# EAGLE design main.02 (EAGLE 9.5.1)

## Sheet 1 of 3: MSP430FR5989 Main Components
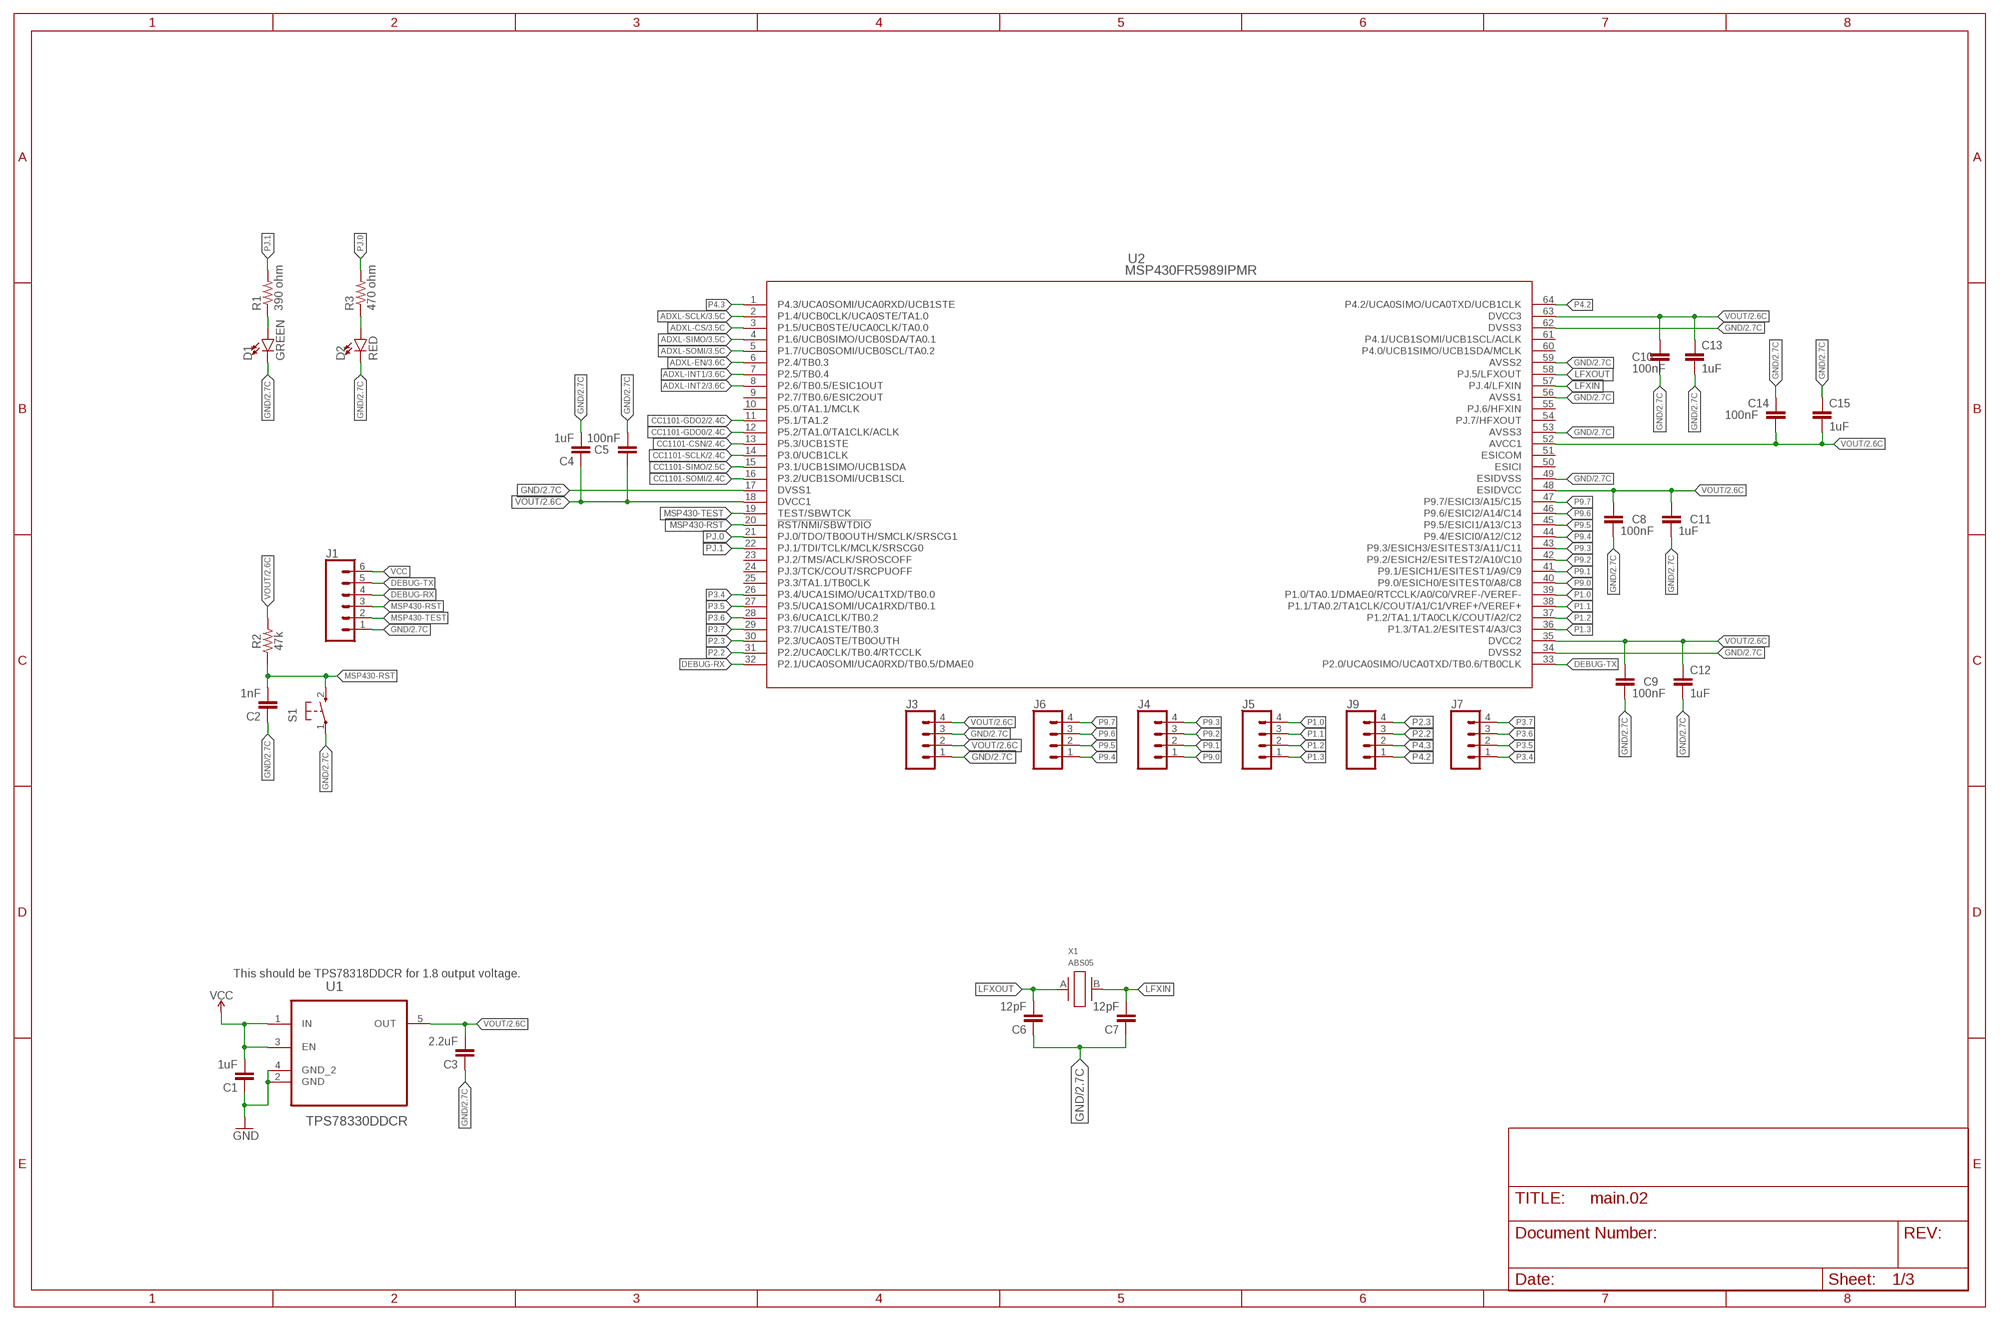
[diagram p0: schematic, sheet 1]

### Parts
C1  1uF  C-EU0603  [0603]
C2  1nF  C-EU0603  [0603]
C3  2.2uF  C-EU0603  [0603]
C4  1uF  C-EU0603  [0603]
C5  100nF  C-EU0603  [0603]
C6  12pF  C-EU0603  [0603]
C7  12pF  C-EU0603  [0603]
C8  100nF  C-EU0603  [0603]
C9  100nF  C-EU0603  [0603]
C10  100nF  C-EU0603  [0603]
C11  1uF  C-EU0603  [0603]
C12  1uF  C-EU0603  [0603]
C13  1uF  C-EU0603  [0603]
C14  100nF  C-EU0603  [0603]
C15  1uF  C-EU0603  [0603]
D1  GREEN  LED-GREEN0603  [LED-0603]
D2  RED  LED-RED0603  [LED-0603]
J1  CONN_06SILK_FEMALE_PTH  [1X06]
J3  CONN_041.27MM  [1X04_1.27MM]
J4  CONN_041.27MM  [1X04_1.27MM]
J5  CONN_041.27MM  [1X04_1.27MM]
J6  CONN_041.27MM  [1X04_1.27MM]
J7  CONN_041.27MM  [1X04_1.27MM]
J9  CONN_041.27MM  [1X04_1.27MM]
R1  390 ohm  R-EU  [0402]
R2  47k  47KOHM-0603-1/10W-1%  [0603]
R3  470 ohm  R-EU  [0402]
S1  ELECTRICALMETER_PB  [ELECTRICALMETER_PBTH]
U1  TPS78330DDCR  [SOT95P280X110-5N]
U2  MSP430FR5989IPMR  [PM64]
X1  ABS05  ABS05-32.768KHZ-9-T  [ABS05]

### Nets
ADXL-CS: U2.3(P1.5/UCB0STE/UCA0CLK/TA0.0) ; also sheet 3
ADXL-EN: U2.6(P2.4/TB0.3) ; also sheet 3
ADXL-INT1: U2.7(P2.5/TB0.4) ; also sheet 3
ADXL-INT2: U2.8(P2.6/TB0.5/ESIC1OUT) ; also sheet 3
ADXL-SCLK: U2.2(P1.4/UCB0CLK/UCA0STE/TA1.0) ; also sheet 3
ADXL-SIMO: U2.4(P1.6/UCB0SIMO/UCB0SDA/TA0.1) ; also sheet 3
ADXL-SOMI: U2.5(P1.7/UCB0SOMI/UCB0SCL/TA0.2) ; also sheet 3
CC1101-CSN: U2.13(P5.3/UCB1STE) ; also sheet 2
CC1101-GDO0: U2.12(P5.2/TA1.0/TA1CLK/ACLK) ; also sheet 2
CC1101-GDO2: U2.11(P5.1/TA1.2) ; also sheet 2
CC1101-SCLK: U2.14(P3.0/UCB1CLK) ; also sheet 2
CC1101-SIMO: U2.15(P3.1/UCB1SIMO/UCB1SDA) ; also sheet 2
CC1101-SOMI: U2.16(P3.2/UCB1SOMI/UCB1SCL) ; also sheet 2
DEBUG-RX: J1.4 U2.32(P2.1/UCA0SOMI/UCA0RXD/TB0.5/DMAE0)
DEBUG-TX: J1.5 U2.33(P2.0/UCA0SIMO/UCA0TXD/TB0.6/TB0CLK)
GND: C1.1 C2.1 C3.1 C4.2 C5.2 C6.1 C7.1 C8.2 C9.2 C10.2 C11.2 C12.2 C13.2 C14.1 C15.1 D1.C D2.C J1.1 J3.1 J3.3 S1.1(P) U1.2(GND) U1.4(GND_2) U2.17(DVSS1) U2.34(DVSS2) U2.49(ESIDVSS) U2.53(AVSS3) U2.56(AVSS1) U2.59(AVSS2) U2.62(DVSS3) ; also sheet 2,3
LFXIN: C7.2 U2.57(PJ.4/LFXIN) X1.B
LFXOUT: C6.2 U2.58(PJ.5/LFXOUT) X1.A
MSP430-RST: C2.2 J1.3 R2.1 S1.2(S) U2.20(!RST/NMI/SBWTDIO)
MSP430-TEST: J1.2 U2.19(TEST/SBWTCK)
N$19: D1.A R1.1
N$20: D2.A R3.1
P1.0: J5.4 U2.39(P1.0/TA0.1/DMAE0/RTCCLK/A0/C0/VREF-/VEREF-)
P1.1: J5.3 U2.38(P1.1/TA0.2/TA1CLK/COUT/A1/C1/VREF+/VEREF+)
P1.2: J5.2 U2.37(P1.2/TA1.1/TA0CLK/COUT/A2/C2)
P1.3: J5.1 U2.36(P1.3/TA1.2/ESITEST4/A3/C3)
P2.2: J9.3 U2.31(P2.2/UCA0CLK/TB0.4/RTCCLK)
P2.3: J9.4 U2.30(P2.3/UCA0STE/TB0OUTH)
P3.4: J7.1 U2.26(P3.4/UCA1SIMO/UCA1TXD/TB0.0)
P3.5: J7.2 U2.27(P3.5/UCA1SOMI/UCA1RXD/TB0.1)
P3.6: J7.3 U2.28(P3.6/UCA1CLK/TB0.2)
P3.7: J7.4 U2.29(P3.7/UCA1STE/TB0.3)
P4.2: J9.1 U2.64(P4.2/UCA0SIMO/UCA0TXD/UCB1CLK)
P4.3: J9.2 U2.1(P4.3/UCA0SOMI/UCA0RXD/UCB1STE)
P9.0: J4.1 U2.40(P9.0/ESICH0/ESITEST0/A8/C8)
P9.1: J4.2 U2.41(P9.1/ESICH1/ESITEST1/A9/C9)
P9.2: J4.3 U2.42(P9.2/ESICH2/ESITEST2/A10/C10)
P9.3: J4.4 U2.43(P9.3/ESICH3/ESITEST3/A11/C11)
P9.4: J6.1 U2.44(P9.4/ESICI0/A12/C12)
P9.5: J6.2 U2.45(P9.5/ESICI1/A13/C13)
P9.6: J6.3 U2.46(P9.6/ESICI2/A14/C14)
P9.7: J6.4 U2.47(P9.7/ESICI3/A15/C15)
PJ.0: R3.2 U2.21(PJ.0/TDO/TB0OUTH/SMCLK/SRSCG1)
PJ.1: R1.2 U2.22(PJ.1/TDI/TCLK/MCLK/SRSCG0)
VCC: C1.2 J1.6 U1.1(IN) U1.3(EN)
VOUT: C3.2 C4.1 C5.1 C8.1 C9.1 C10.1 C11.1 C12.1 C13.1 C14.2 C15.2 J3.2 J3.4 R2.2 U1.5(OUT) U2.18(DVCC1) U2.35(DVCC2) U2.48(ESIDVCC) U2.52(AVCC1) U2.63(DVCC3) ; also sheet 2,3
Unconnected: U2.9(P2.7/TB0.6/ESIC2OUT) U2.10(P5.0/TA1.1/MCLK) U2.23(PJ.2/TMS/ACLK/SROSCOFF) U2.24(PJ.3/TCK/COUT/SRCPUOFF) U2.25(P3.3/TA1.1/TB0CLK) U2.50(ESICI) U2.51(ESICOM) U2.54(PJ.7/HFXOUT) U2.55(PJ.6/HFXIN) U2.60(P4.0/UCB1SIMO/UCB1SDA/MCLK) U2.61(P4.1/UCB1SOMI/UCB1SCL/ACLK)

### Notes on the sheet
- This should be TPS78318DDCR for 1.8 output voltage.

## Sheet 2 of 3: CC1101 components
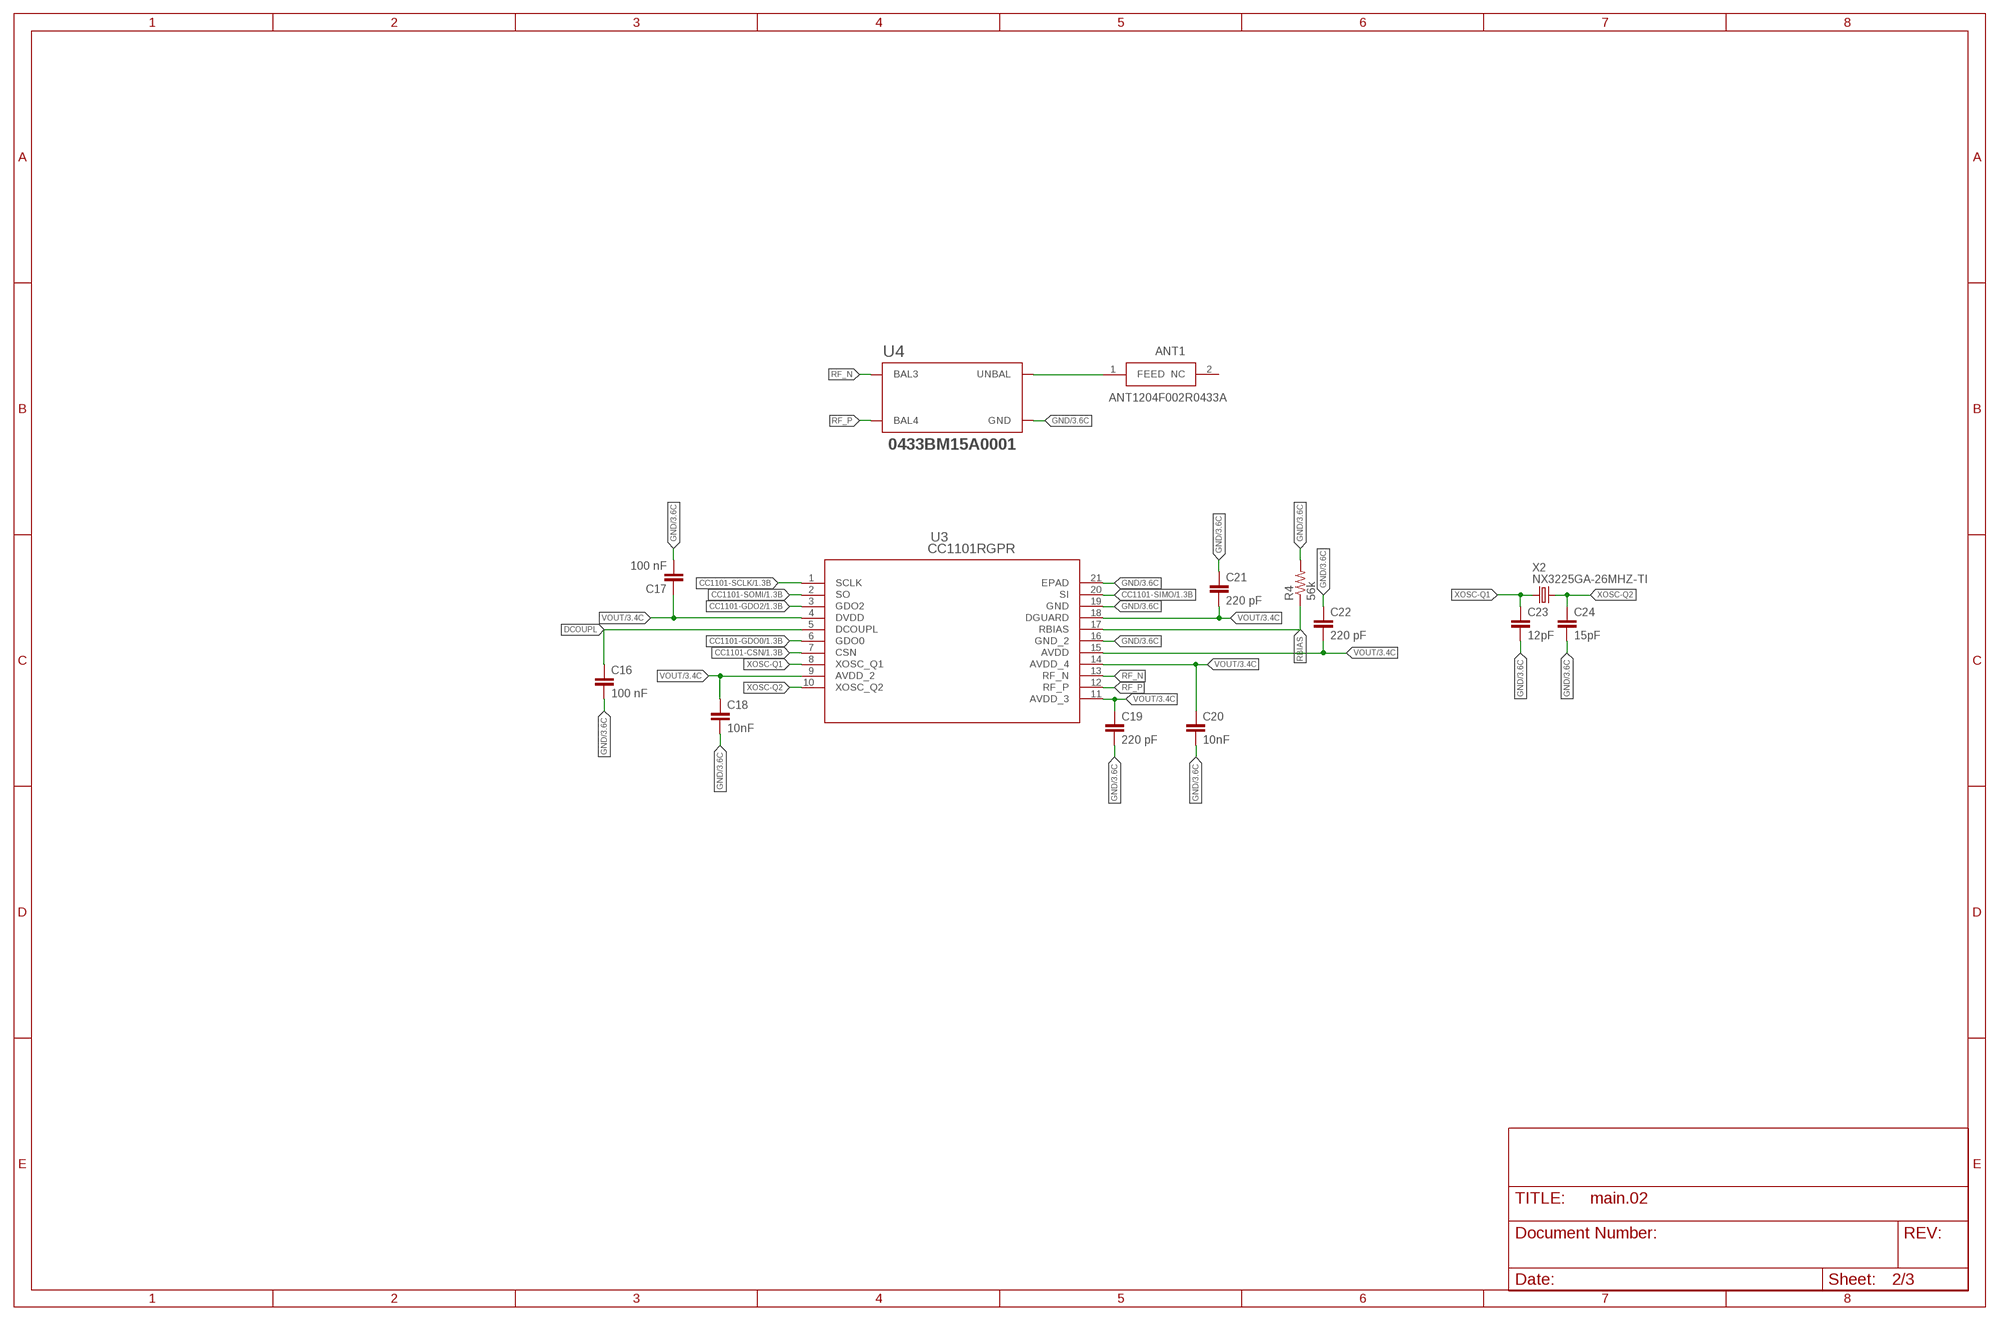
[diagram p1: schematic, sheet 2]

### Parts
ANT1  ANT1204F002R0433A  [ANTC12340X180N]
C16  100 nF  C-EU0603  [0603]
C17  100 nF  C-EU0603  [0603]
C18  10nF  C-EU0603  [0603]
C19  220 pF  C-EU0603  [0603]
C20  10nF  C-EU0603  [0603]
C21  220 pF  C-EU0603  [0603]
C22  220 pF  C-EU0603  [0603]
C23  12pF  C-EU0603  [0603]
C24  15pF  C-EU0603  [0603]
R4  56k  R-EU0603  [0603]
U3  CC1101RGPR  [RGP20_2P4X2P4]
U4  0433BM15A0001  [XXXXBM15A0001]
X2  NX3225GA-26MHZ-TI  XTAL-3.2X2.5  [XTAL-3.2X2.5]

### Nets
CC1101-CSN: U3.7(CSN) ; also sheet 1
CC1101-GDO0: U3.6(GDO0) ; also sheet 1
CC1101-GDO2: U3.3(GDO2) ; also sheet 1
CC1101-SCLK: U3.1(SCLK) ; also sheet 1
CC1101-SIMO: U3.20(SI) ; also sheet 1
CC1101-SOMI: U3.2(SO) ; also sheet 1
DCOUPL: C16.1 U3.5(DCOUPL)
GND: C16.2 C17.2 C18.2 C19.2 C20.2 C21.1 C22.1 C23.2 C24.2 R4.2 U3.16(GND_2) U3.19(GND) U3.21(EPAD) U4.2(GND) U4.5(GND) U4.6(GND) ; also sheet 1,3
N$3: ANT1.1(FEED) U4.1(UNBAL)
RBIAS: R4.1 U3.17(RBIAS)
RF_N: U3.13(RF_N) U4.3(BAL3)
RF_P: U3.12(RF_P) U4.4(BAL4)
VOUT: C17.1 C18.1 C19.1 C20.1 C21.2 C22.2 U3.4(DVDD) U3.9(AVDD_2) U3.11(AVDD_3) U3.14(AVDD_4) U3.15(AVDD) U3.18(DGUARD) ; also sheet 1,3
XOSC-Q1: C23.1 U3.8(XOSC_Q1) X2.1
XOSC-Q2: C24.1 U3.10(XOSC_Q2) X2.3
Unconnected: ANT1.2(NC)

## Sheet 3 of 3: ADXL362 Acceloremeter
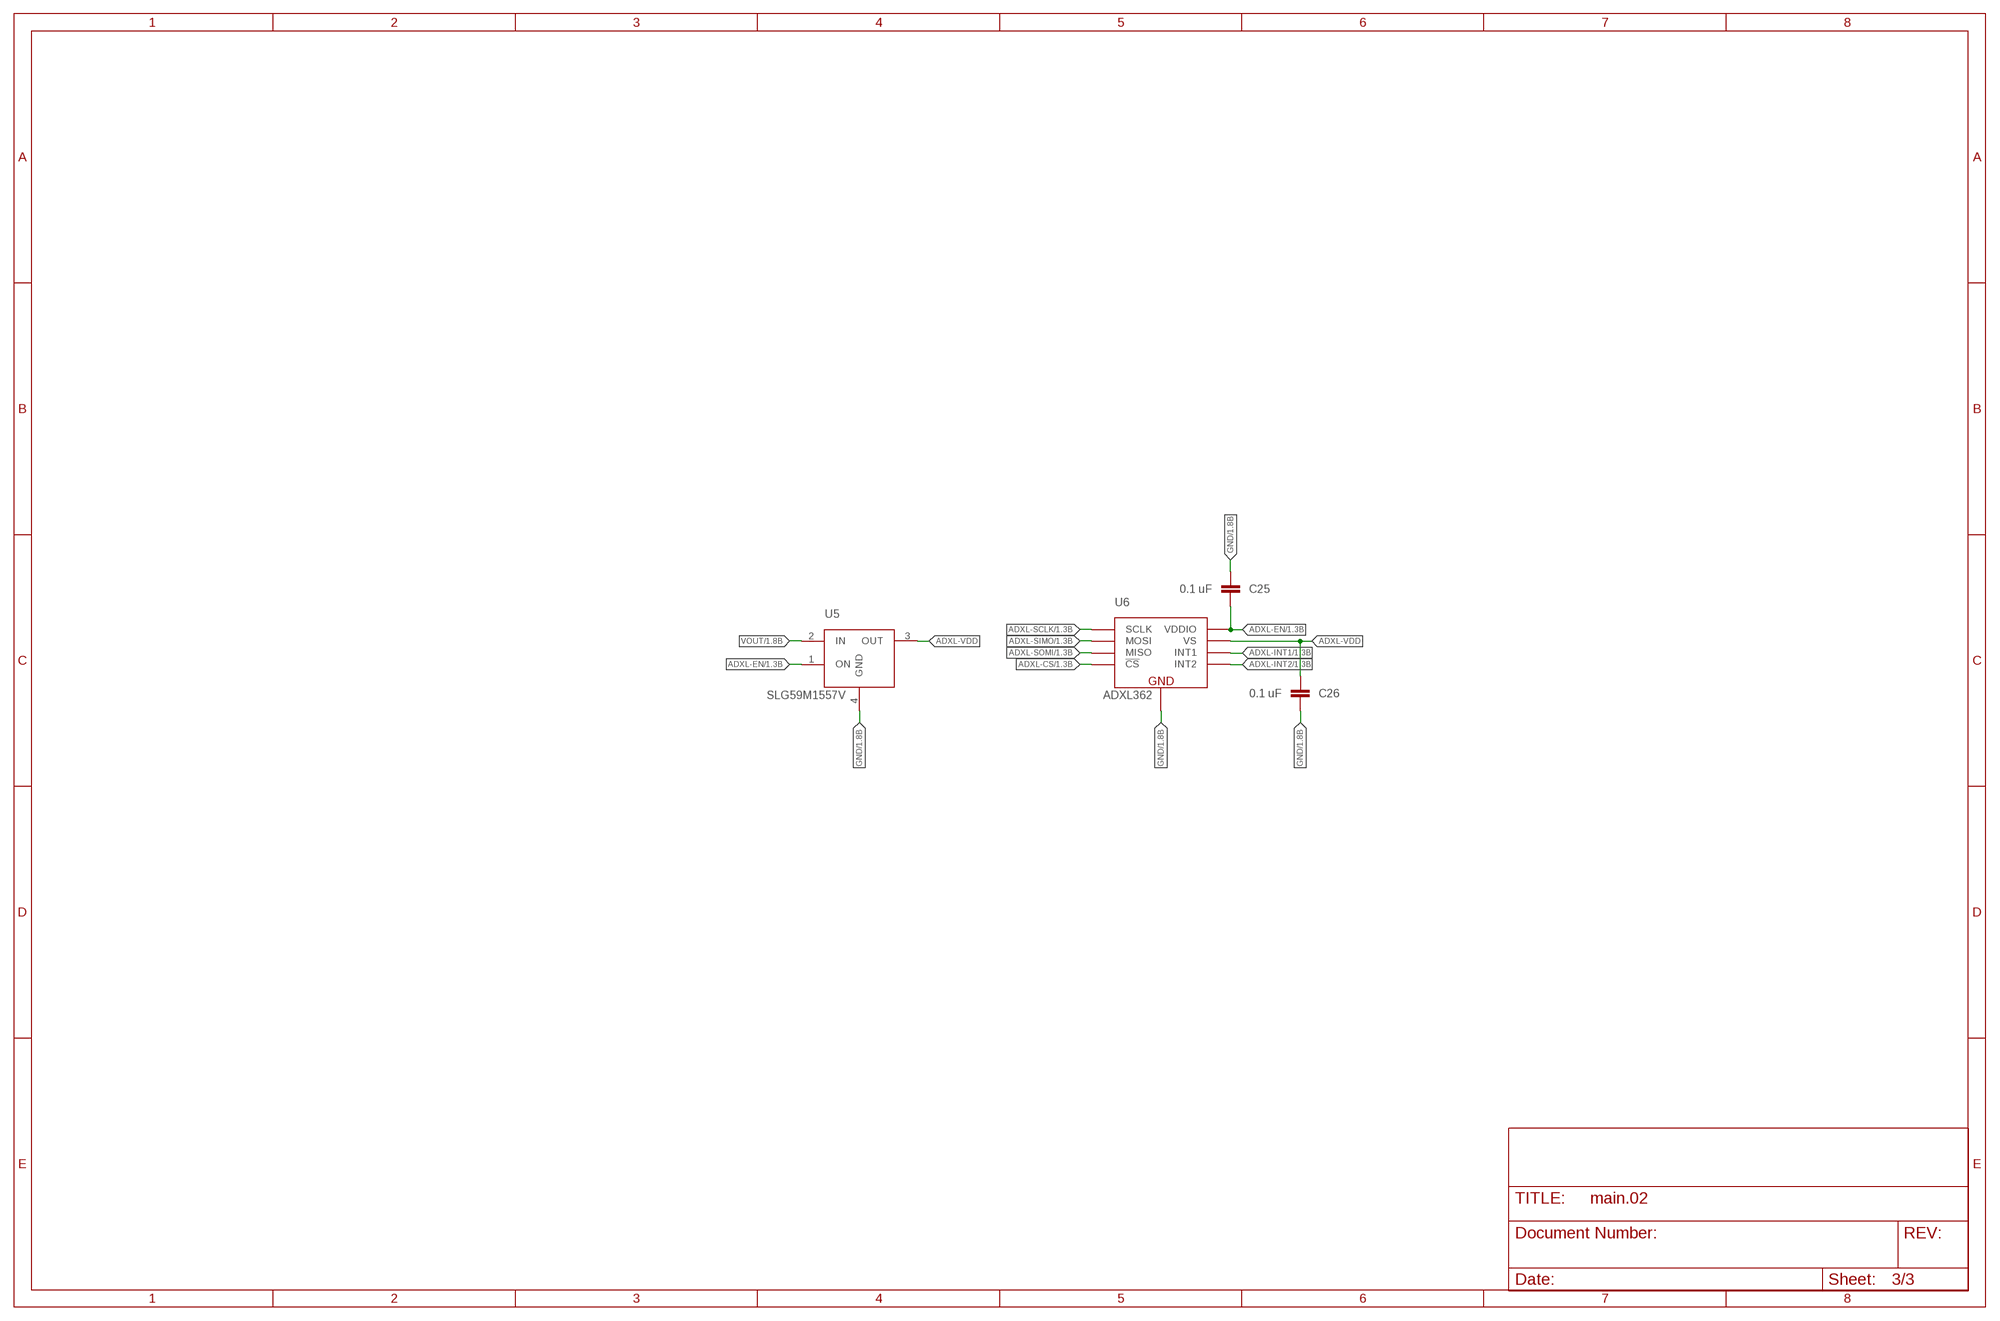
[diagram p2: schematic, sheet 3]

### Parts
C25  0.1 uF  C-EU0603  [0603]
C26  0.1 uF  C-EU0603  [0603]
U5  SLG59M1557V  [4STDFN]
U6  ADXL362  [ADXL362]

### Nets
ADXL-CS: U6.P$8(!CS) ; also sheet 1
ADXL-EN: C25.1 U5.1(ON) U6.P$1(VDDIO) ; also sheet 1
ADXL-INT1: U6.P$11(INT1) ; also sheet 1
ADXL-INT2: U6.P$9(INT2) ; also sheet 1
ADXL-SCLK: U6.P$4(SCLK) ; also sheet 1
ADXL-SIMO: U6.P$6(MOSI) ; also sheet 1
ADXL-SOMI: U6.P$7(MISO) ; also sheet 1
ADXL-VDD: C26.2 U5.3(OUT) U6.P$14(VS)
GND: C25.2 C26.1 U5.4(GND) U6.P$12(GND) U6.P$13(GND) U6.P$16(GND) ; also sheet 1,2
VOUT: U5.2(IN) ; also sheet 1,2

## Library data of the parts
ANT1 = ANT1204F002R0433A:ANT1204F002R0433A: YAGEO - ANT1204F002R0433A - ANTENNA CHIP, 433MHZ, 50 OHM, 1204 Source: Datasheet <http://www.yageo.com/documents/recent/An_SMD_UHF_433_1204_0.pdf>; DESCRIPTION: YAGEO - ANT1204F002R0433A - ANTENNA CHIP, 433MHZ, 50 OHM, 1204; HEIGHT: 1.8mm; MANUFACTURER_NAME: YAGEO (PHYCOMP); MANUFACTURER_PART_NUMBER: ANT1204F002R0433A; MOUSER_PART_NUMBER: 603-ANT1204F002R0433; MOUSER_PRICE-STOCK: https://www.mouser.com/Search/Refine.aspx?Keyword=603-ANT1204F002R0433
C1-C5 C8-C15 C25 C26 = tiny_passives:C-EU
C6 C7 = tiny_passives:C-EU; MPN: CL10C120JB8NNNC
C16-C22 = tiny_passives:C-EU; MPN: GCJ188R71H104KA12D
C23 = tiny_passives:C-EU; MPN: 06035A120FAT2A
C24 = tiny_passives:C-EU; MPN: C1608C0G1H150J080AA
D1 = SparkFun-LED:LED-GREEN: Green SMD LED Used in manufacturing of various products at SparkFun Packages: 0603 - SMD 0603 package [Product Link] <http://www.futureelectronics.com/en/technologies/semiconductors/optoelectronics/leds/Pages/9894312-LTST-C190GKT.aspx?CrossPart=HSMG-C190&IM=0> LilyPad 1206 - SMD1206 LilyPad package [Product Link] <http://www.futureelectronics.com/en/Technologies/Product.aspx?ProductID=IN150NGHARVATEKCORPORATION2049943&IM=0> 1206 - SMD1206 package [Product Link] <http://www.futureelectronics.com/en/technologies/semiconductors/optoelectronics/leds/Pages/8315665-LTST-C150KGKT.aspx?IM=0> 1206 Bottom Mount -SMD 1206 Bottom Mount [Product Link] <http://www.digikey.com/product-detail/en/lite-on-inc/LTST-C230KGKT/160-1456-1-ND/386854> SparkFun Products: Pro Mini 328 -5V <https://www.sparkfun.com/products/821> RedBoard <https://www.sparkfun.com/products/12757> MP3 Trigger <https://www.sparkfun.com/products/13720> Makey Makey <https://www.sparkfun.com/products/11076>; PROD_ID: DIO-00821
D2 = SparkFun-LED:LED-RED: Red SMD LED Used in manufacturing of most products at SparkFun Packages: 0603 - SMD 0603 package [Product Link] <http://docs.avagotech.com/docs/AV02-0551EN> 0603 SMART - SMD 0603 SMART package ( more efficient and expensive)[Product Link] <http://www.osram-os.com/Graphics/XPic2/00077099_0.pdf> 1206 - SMD1206 package [Product Link] <https://www.sparkfun.com/datasheets/DevTools/LilyPad/Q150OVS4.pdff> SparkFun Products: Pro Mini 328 -5V <https://www.sparkfun.com/products/821> RedBoard <https://www.sparkfun.com/products/12757> IOIO-OTG <https://www.sparkfun.com/products/13613>; PROD_ID: DIO-00819
J1 = SparkFun-Connectors:CONN_06: Multi connection point. Often used as Generic Header-pin footprint for 0.1 inch spaced/style header connections On any of the 0.1 inch spaced packages, you can populate with these: Break Away Headers - Straight <https://www.sparkfun.com/products/116> (PRT-00116) Break Away Male Headers - Right Angle <https://www.sparkfun.com/products/553> (PRT-00553) Female Headers <https://www.sparkfun.com/products/115> (PRT-00115) Break Away Headers - Machine Pin <https://www.sparkfun.com/products/117> (PRT-00117) Break Away Female Headers - Swiss Machine Pin <https://www.sparkfun.com/products/743> (PRT-00743) Arduino Stackable Header - 6 Pin <https://www.sparkfun.com/products/9280> (PRT-09280) For SCREWTERMINALS and SPRING TERMINALS visit here: Screw Terimnals on SparkFun.com <https://www.sparkfun.com/search/results?term=Screw+Terminals> (5mm/3.5mm/2.54mm spacing) This device is also useful as a general connection point to wire up your design to another part of your project. Our various solder wires solder well into these plated through hole pads. Hook-Up Wire - Assortment (Stranded, 22 AWG) <https://www.sparkfun.com/products/11375> (PRT-11375) Hook-Up Wire - Assortment (Solid Core, 22 AWG) <https://www.sparkfun.com/products/11367> (PRT-11367) View the entire wire category on our website here <https://www.sparkfun.com/categories/141>; PROD_ID: CONN-08437
J3-J7 J9 = SparkFun-Connectors:CONN_04: Multi connection point. Often used as Generic Header-pin footprint for 0.1 inch spaced/style header connections On any of the 0.1 inch spaced packages, you can populate with these: Break Away Headers - Straight <https://www.sparkfun.com/products/116> (PRT-00116) Break Away Male Headers - Right Angle <https://www.sparkfun.com/products/553> (PRT-00553) Female Headers <https://www.sparkfun.com/products/115> (PRT-00115) Break Away Headers - Machine Pin <https://www.sparkfun.com/products/117> (PRT-00117) Break Away Female Headers - Swiss Machine Pin <https://www.sparkfun.com/products/743> (PRT-00743) For SCREWTERMINALS and SPRING TERMINALS visit here: Screw Terimnals on SparkFun.com <https://www.sparkfun.com/search/results?term=Screw+Terminals> (5mm/3.5mm/2.54mm spacing) This device is also useful as a general connection point to wire up your design to another part of your project. Our various solder wires solder well into these plated through hole pads. Hook-Up Wire - Assortment (Stranded, 22 AWG) <https://www.sparkfun.com/products/11375> (PRT-11375) Hook-Up Wire - Assortment (Solid Core, 22 AWG) <https://www.sparkfun.com/products/11367> (PRT-11367) View the entire wire category on our website here <https://www.sparkfun.com/categories/141> Special notes: Molex polarized connector foot print use with SKU : PRT-08231 with associated crimp pins and housings. 1MM SMD Version SKU: PRT-10208; SPICEPREFIX: E
R1 R3 = tiny_passives:R-EU
R2 = SparkFun-Resistors:47KOHM: 47kΩ resistor A resistor is a passive two-terminal electrical component that implements electrical resistance as a circuit element. Resistors act to reduce current flow, and, at the same time, act to lower voltage levels within circuits. - Wikipedia; PROD_ID: RES-07871
R4 = tiny_passives:R-EU; MPN: ERJ-3GEYJ563V
S1 = tactile-switch:ELECTRICALMETER_PB: OMRON SWITCH
U1 = Texas Instruments_By_element14_Batch_1:TPS78330DDCR: 500nA IQ, 150mA, Ultra-Low Quiescent Current Low-Dropout Linear Regulator; MPN: TPS78330DDCR; OC_FARNELL: -; OC_NEWARK: 72R6681; PACKAGE: SOT-5; SUPPLIER: Texas Instruments
U2 = msp430fr5989IPMR:MSP430FR5989IPMR; MANUFACTURER_PART_NUMBER: MSP430FR5989IPMR; VENDOR: Texas Instruments
U3 = cc1101RGPR:CC1101RGPR; MANUFACTURER_PART_NUMBER: CC1101RGPR; VENDOR: Vendor
U4 = johanson-baluns:0433BM15A0001: 430/403 MHz Impedance Matched Balun/LPF Integrated Component for T.I. Chipsets: CC1100, CC1101, CC110L, CC1111, CC1130, CC1131, CC1150, CC1151, CC113L, CC115L, CC430 and RF430.
U5 = loadswitches:SLG59M1557V: SILEGO SLG59M1557V: Ultra-small 28.5 mΩ, 1.0 A Integrated Power Switch with Discharge The SLG59M1557V is designed for load switching applications with ultra low quiescent current (20nA), and low turn on voltage (0.85V). The part comes with one 28.5 mΩ 1.0 A rated P-channel MOSFET controlled by a single ON control pin. The product is packaged in an ultra-small 1.0 x 1.0 mm package.; MANAFACTURER: SLG59M1557V; MOUSER: 402-SLG59M1557V; MPN: SLG59M1557V
U6 = adxl362:ADXL362: Micropower 3-axis accelerometer 2/4/8g digital output (SPI); DIGIKEY: ADXL362BCCZ-RL7CT-ND; MPN: ADXL362BCCZ-RL7
X1 = abs05:ABS05-32.768KHZ: 32.768kHz Crystal; DIGIKEY: 535-11897-1-ND; MPN: ABS05-32.768KHZ-9-T
X2 = cc1101:XTAL

## Net classes
1 Ground: width 0.203 mm, drill 0.305 mm, clearance 0.152 mm to class 0, clearance 0.152 mm

## Board
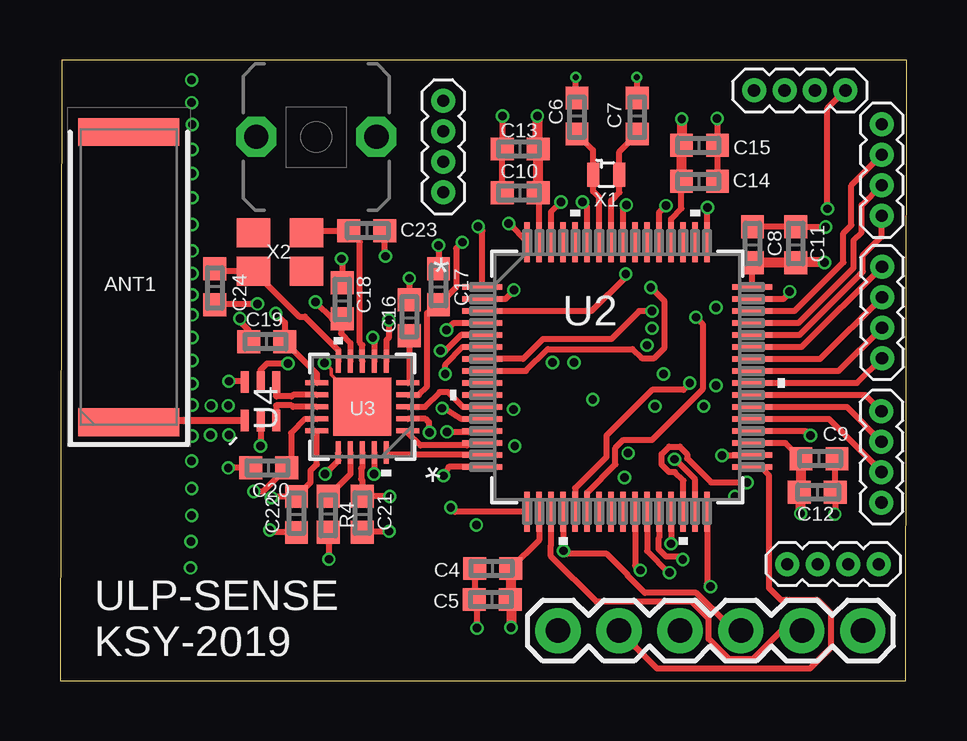
[diagram p3: board, top side]
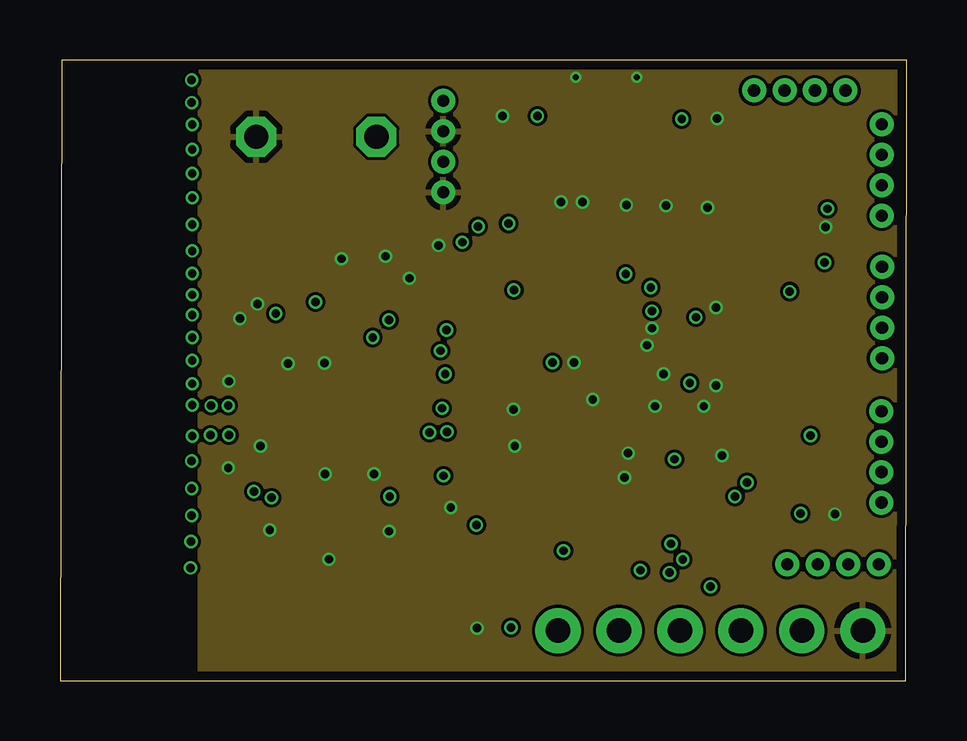
[diagram p4: board, inner layer GND]
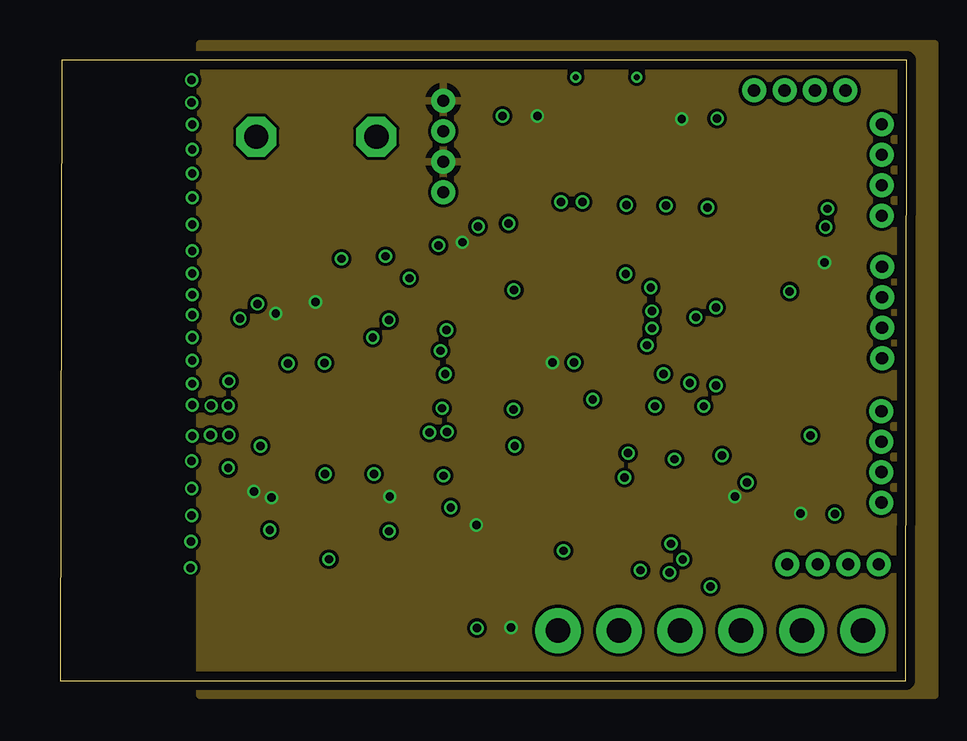
[diagram p5: board, inner layer VOUT]
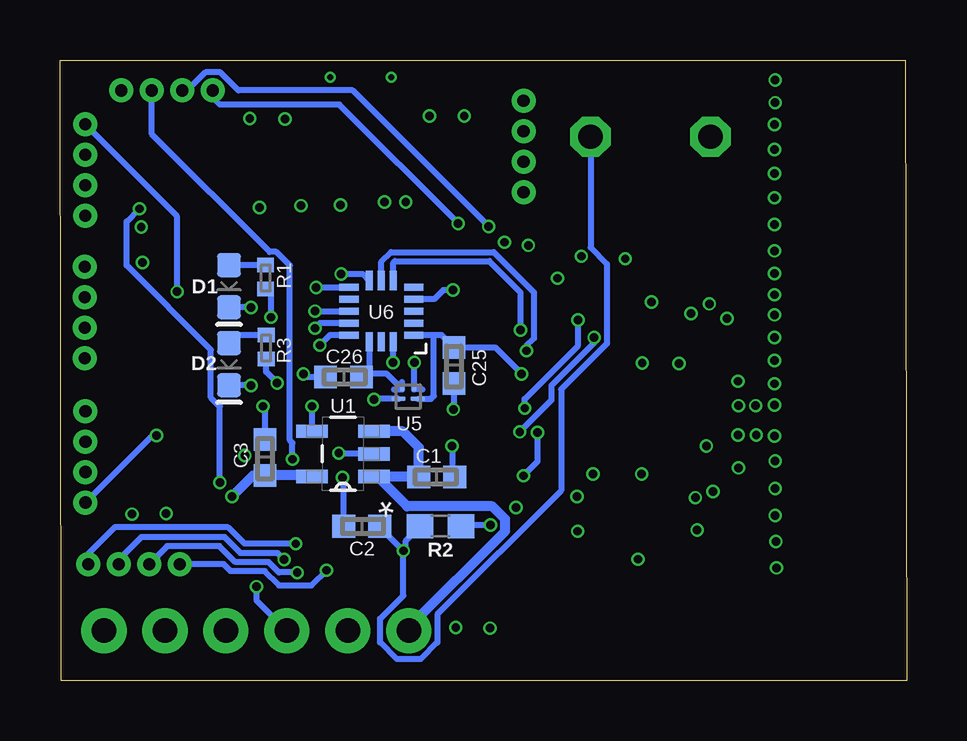
[diagram p6: board, bottom side, seen from below]

Size 35.29 x 25.86 mm. Coordinates in mm from the lower left corner, seen from the top.
Outline: 0,0 35.23,0 35.29,25.86 0.08,25.86 0,0
Copper layers (1*2*15*16): Top 0.035559375mm / dielectric 0.17018125mm / GND 0.01778125mm / dielectric 47mil / VOUT 0.01778125mm / dielectric 0.17018125mm / Bottom 0.035559375mm
Design rules "oshpark-4layer": minimum track width 5mil, minimum drill 10mil, track to track 5mil, track to pad 5mil, pad to pad 5mil, via to via 5mil, smd to smd 5mil, copper to edge 15mil, drill to drill 6mil, minimum pad ring 4mil, minimum via ring 4mil, stop-mask expansion 2.5mil, vias tented up to drill 0mil, thermal gap 10mil

### Footprints (pad centres in the part's own frame; a part is rotated, then mirrored left to right if it is on the bottom)
ANTC12340X180N = smd 1.15 x 4.2: 1 -6.05,0; 2 6.05,0
0603 = smd 0.95 x 0.95: 1 -0.75,0; 2 0.75,0
LED-0603 = smd 1 x 1: A -0.877,0; C 0.877,0
1X06 = drill 1.016 pad 1.88: 1 0,0; 2 2.54,0; 3 5.08,0; 4 7.62,0; 5 10.16,0; 6 12.7,0
1X04_1.27MM = drill 0.508 pad 1: 1 0,0; 2 1.27,0; 3 2.54,0; 4 3.81,0
0402 = smd 0.6 x 0.7: 1 -0.5,0; 2 0.5,0
0603' = smd 1.1 x 1: 1 -0.85,0; 2 0.85,0
ELECTRICALMETER_PBTH = drill 1.016 pad 1.676 octagon: 1 -0.001,0.001; 2 5.001,0.001
SOT95P280X110-5N = smd 1.321 x 0.559: 1 -1.295,0.94; 2 -1.295,0; 3 -1.295,-0.94; 4 1.295,-0.94; 5 1.295,0.94
PM64 = smd 1.664 x 0.229: 1 -5.62,3.75; 2 -5.62,3.25; 3 -5.62,2.75; 4 -5.62,2.25; 5 -5.62,1.75; 6 -5.62,1.25; 7 -5.62,0.75; 8 -5.62,0.25; 9 -5.62,-0.25; 10 -5.62,-0.75; 11 -5.62,-1.25; 12 -5.62,-1.75; 13 -5.62,-2.25; 14 -5.62,-2.75; 15 -5.62,-3.25; 16 -5.62,-3.75; 33 5.62,-3.75; 34 5.62,-3.25; 35 5.62,-2.75; 36 5.62,-2.25; 37 5.62,-1.75; 38 5.62,-1.25; 39 5.62,-0.75; 40 5.62,-0.25; 41 5.62,0.25; 42 5.62,0.75; 43 5.62,1.25; 44 5.62,1.75; 45 5.62,2.25; 46 5.62,2.75; 47 5.62,3.25; 48 5.62,3.75 | smd 0.229 x 1.664: 17 -3.75,-5.62; 18 -3.25,-5.62; 19 -2.75,-5.62; 20 -2.25,-5.62; 21 -1.75,-5.62; 22 -1.25,-5.62; 23 -0.75,-5.62; 24 -0.25,-5.62; 25 0.25,-5.62; 26 0.75,-5.62; 27 1.25,-5.62; 28 1.75,-5.62; 29 2.25,-5.62; 30 2.75,-5.62; 31 3.25,-5.62; 32 3.75,-5.62; 49 3.75,5.62; 50 3.25,5.62; 51 2.75,5.62; 52 2.25,5.62; 53 1.75,5.62; 54 1.25,5.62; 55 0.75,5.62; 56 0.25,5.62; 57 -0.25,5.62; 58 -0.75,5.62; 59 -1.25,5.62; 60 -1.75,5.62; 61 -2.25,5.62; 62 -2.75,5.62; 63 -3.25,5.62; 64 -3.75,5.62
RGP20_2P4X2P4 = smd 0.953 x 0.203: 1 -1.899,1; 2 -1.899,0.5; 3 -1.899,0; 4 -1.899,-0.5; 5 -1.899,-1; 11 1.899,-1; 12 1.899,-0.5; 13 1.899,0; 14 1.899,0.5; 15 1.899,1 | smd 0.203 x 0.953: 6 -1,-1.899; 7 -0.5,-1.899; 8 0,-1.899; 9 0.5,-1.899; 10 1,-1.899; 16 1,1.899; 17 0.5,1.899; 18 0,1.899; 19 -0.5,1.899; 20 -1,1.899 | smd 2.413 x 2.413: 21 0,0
XXXXBM15A0001 = smd 0.33 x 0.9: 1 0.65,0.8; 2 0,0.8; 3 -0.65,0.8; 4 -0.65,-0.8; 5 0,-0.8; 6 0.65,-0.8
4STDFN = smd 0.6 x 0.2: 1 -0.4,0.1; 4 0.4,0.1 | smd 0.152 x 0.152: 2 -0.25,-0.3; 3 0.25,-0.3
ADXL362 = smd 0.8 x 0.3: P$1 -1.35,1; P$2 -1.35,0.5; P$3 -1.35,0; P$4 -1.35,-0.5; P$5 -1.35,-1; P$9 1.35,-1; P$10 1.35,-0.5; P$11 1.35,0; P$12 1.35,0.5; P$13 1.35,1 | smd 0.3 x 0.8: P$6 -0.5,-1.275; P$7 0,-1.275; P$8 0.5,-1.275; P$14 0.5,1.275; P$15 0,1.275; P$16 -0.5,1.275
ABS05 = smd 0.5 x 1: A -0.55,0; B 0.55,0
XTAL-3.2X2.5 = smd 1.4 x 1.2: 1 -1.1,-0.8; 2 1.1,-0.8; 3 1.1,0.8; 4 -1.1,0.8

### Placement (x,y rotation side)
ANT1  2.87,16.81 90 top
C1  19.58,8.48 180 bottom
C2  22.71,6.43 0 bottom
C3  26.75,9.3 270 bottom
C4  18.03,4.67 180 top
C5  18.01,3.38 180 top
C6  21.54,23.52 270 top
C7  24.05,23.52 270 top
C8  28.85,18.16 90 top
C9  31.62,9.25 0 top
C10  19.18,20.32 180 top
C11  30.66,18.16 90 top
C12  31.55,7.85 0 top
C13  19.18,22.15 180 top
C14  26.64,20.8 180 top
C15  26.64,22.3 180 top
C16  14.55,15.11 90 top
C17  15.77,16.41 90 top
C18  11.76,15.82 90 top
C19  8.61,14.12 180 top
C20  8.7,8.86 180 top
C21  12.6,6.93 90 top
C22  9.86,6.92 90 top
C23  12.78,18.75 0 top
C24  6.45,16.41 270 top
C25  18.87,13.13 270 bottom
C26  23.47,12.65 0 bottom
D1  28.24,16.43 270 bottom
D2  28.24,13.18 270 bottom
J1  33.45,2.08 180 top
J3  15.97,20.35 90 top
J4  34.25,13.44 90 top
J5  34.23,7.42 90 top
J6  34.24,19.37 90 top
J7  30.3,4.85 0 top
J9  28.92,24.59 0 top
R1  26.72,16.81 270 bottom
R2  47k  [0603']  19.43,6.43 0 bottom
R3  26.7,13.89 270 bottom
R4  11.18,6.93 270 top
S1  8.18,22.66 0 top
U1  23.5,9.45 180 bottom
U2  23.22,12.65 0 top
U3  12.6,11.4 180 top
U4  8.36,11.63 180 top
U5  20.78,11.84 180 bottom
U6  21.89,15.39 180 bottom
X1  22.76,21.08 0 top
X2  9.17,17.86 180 top

### Tracks (layer width: path | path; a pad name or v marks a point on that pad's centre or on a via)
ADXL-CS  (via drill 0.35)
  Top 0.254: U2.3 22.16,15.4 23.57,16.82 v23.57,16.95
  Bottom 0.254: v23.57,16.95 22.67,16.95 U6.P$8
ADXL-EN  (via drill 0.35)
  Top 0.254: v16.05,12.78 16.05,13.17 16.78,13.9 U2.6
  Bottom 0.254: 19.71,14.39 19.38,14.39 C25.1 17.16,13.88 v16.05,12.78 | 19.71,14.39 U6.P$1 | U5.1 19.84,11.74 19.71,11.86 19.71,14.39
ADXL-INT1  (via drill 0.35)
  Top 0.254: U2.7 19.29,13.4 20.12,14.22 22.96,14.22 24.13,15.39 v24.66,15.39
  Bottom 0.254: v24.66,15.39 U6.P$11
ADXL-INT2  (via drill 0.35)
  Top 0.254: U2.8 19.41,12.9 20.33,13.82 23.85,13.82 24.23,13.44 24.76,13.44 25.2,13.87 25.2,15.8 v24.61,16.38
  Bottom 0.254: v24.61,16.38 U6.P$9
ADXL-SCLK  (via drill 0.35)
  Top 0.254: U2.2 18.57,15.9 18.92,16.26 v18.91,16.27
  Bottom 0.254: v18.91,16.27 19.32,16.27 19.69,15.89 U6.P$4
ADXL-SIMO  (via drill 0.35)
  Top 0.254: v16.1,14.61 16.4,14.9 U2.4
  Bottom 0.254: U6.P$6 21.39,17.42 21.34,17.48 17.4,17.48 16.1,16.18 v16.1,14.61
ADXL-SOMI  (via drill 0.35)
  Top 0.254: U2.5 16.71,14.4 16.05,13.74 v15.85,13.74
  Bottom 0.254: v15.85,13.74 15.85,13.94 15.54,14.25 15.54,16.18 17.22,17.86 21.49,17.86 21.89,17.46 U6.P$7
ADXL-VDD
  Bottom 0.254: U5.3 21.67,12.78 22.43,12.78 | C26.2 22.55,12.65 22.43,12.78 | U6.P$14 22.39,12.81 22.43,12.78
CC1101-CSN  (via drill 0.35)
  Top 0.254: v13.03,14.3 13.05,14.28 13.06,14.25 13.1,14.21 U3.7 | U2.13 17.54,10.35 16.14,10.35 v16.13,10.36
  Bottom 0.254: v16.13,10.36 14.81,11.68 14.81,12.29 13.03,14.07 v13.03,14.3
CC1101-GDO0  (via drill 0.35)
  Top 0.254: U2.12 16.72,10.9 16,11.35 v15.92,11.35 | v13.7,15.02 13.7,14.29 13.6,14.19 U3.6
  Bottom 0.254: v15.92,11.35 15.92,11.73 13.69,13.96 v13.69,15.02 v13.7,15.02
CC1101-GDO2
  Top 0.254: U3.3 15.21,11.4 15.82,12.01 16.17,12.01 16.78,11.4 U2.11
CC1101-SCLK
  Top 0.254: U3.1 14.5,10.33 15.02,9.8 16.97,9.8 17.06,9.9 U2.14
CC1101-SIMO
  Top 0.254: U2.15 13.7,9.4 U3.20
CC1101-SOMI  (via drill 0.35)
  Top 0.254: U2.16 16.19,8.9 v15.98,8.53 | v15.39,10.34 15.37,10.36 15.37,10.77 15.23,10.9 U3.2
  Bottom 0.254: v15.98,8.53 15.39,9.12 v15.39,10.34
DCOUPL
  Top 0.254: C16.1 14.55,12.46 U3.5
DEBUG-RX  (via drill 0.35)
  Top 0.254: U2.32 26.97,4.05 v27.1,3.91
  Bottom 0.254: v27.1,3.91 27.1,3.35 J1.4
DEBUG-TX
  Top 0.254: J1.5 24.87,0.51 31.25,0.51 32.13,1.39 32.13,2.79 31.57,3.35 30.05,3.35 29.55,3.85 29.55,8.54 29.19,8.9 U2.33
GND  (via drill 0.25, 0.35)
  Top 0.152: v11.02,13.23 11.29,12.96 11.29,12.74 12.6,11.44 U3.21
  Top 0.254: C10.2 C13.2 18.43,23.51 v18.44,23.52 | v32.28,6.93 32.3,6.95 C12.2 32.3,9.17 C9.2 | C4.2 17.28,3.4 C5.2 17.37,3.26 v17.37,2.19 v17.37,2.18 | v24.03,25.15 24.03,24.3 C7.1 | C6.1 21.49,24.32 v21.49,25.15 | v31.9,18.9 30.67,18.9 C11.2 C8.2 | U2.49 26.97,19.7 v26.97,19.71 | U2.53 24.97,19.5 v25.25,19.79 | v27.38,23.42 27.39,23.41 C15.1 C14.1 | U2.56 23.47,19.68 v23.6,19.81 | v14.55,16.76 C16.2 | U3.19 13.1,8.63 v13.08,8.61 | v11.73,17.58 11.76,17.55 C18.2 | v15.77,18.14 C17.2 | v11.05,8.61 11.6,9.16 U3.16 | R4.2 11.2,6.16 v11.2,5.05 | C21.1 12.64,6.22 v13.72,6.22 | C22.1 8.84,6.17 v8.74,6.27 | C20.2 v7.01,8.86 | v7.49,15.09 7.49,14.97 7.86,14.61 C19.2 | v13.56,17.68 13.53,17.72 C23.2 | C24.2 6.49,15.7 v8.23,15.7 | U4.5 8.36,12.94 8.62,13.21 v9.5,13.21 | U4.6 7.67,12.47 v7.04,12.47 | U4.2 v8.36,9.78 | U2.62 20.47,19.53 v20.88,19.94 | U2.59 21.97,19.74 v21.77,19.94 | U2.34 28.81,9.37 v27.58,9.37 | U2.17 16.47,7.03 v16.28,7.21
  Bottom 0.254: C25.2 18.87,11.33 v18.9,11.3 | U5.4 22.17,11.74 v22.2,11.71 | U6.P$16 21.41,14.1 v21.41,13.26 | v25.15,12.78 25.02,12.65 C26.1 | U6.P$12 24.45,14.89 v24.66,14.68 | U6.P$13 24.04,14.39 v24.46,13.97 | v24.79,11.43 U1.4 | v26.82,11.43 26.75,11.35 C3.1 | v18.95,9.78 18.95,8.6 C1.1 | U1.2 23.65,9.45 v23.67,9.47 | v27.33,12.29 27.34,12.31 D2.C | v27.33,15.55 27.34,15.56 D1.C | C2.1 23.46,8.4 v23.52,8.46
  pour GND: 5.83,26.62 5.83,-0.56 36.53,-0.56 36.53,26.62
LFXIN
  Top 0.254: C7.2 24.04,22.77 23.31,22.04 X1.B 23.31,20.34 22.97,19.99 U2.57
LFXOUT
  Top 0.254: U2.58 22.47,20.13 22.21,20.39 X1.A 22.21,22.1 C6.2
MSP430-RST  (via drill 0.35)
  Top 0.254: U2.20 20.97,5.43 v20.98,5.41 21.11,5.28 22.78,5.28 23.65,4.42 23.65,4.38 24.37,3.66 26.52,3.66 28.09,2.08 J1.3
  Bottom 0.254: R2.1 20.28,6.11 20.34,6.05 20.65,6.05 20.87,5.83 20.87,5.52 v20.98,5.41 | v20.98,5.41 21.96,6.39 C2.2 | S1.2 13.18,18.05 12.5,17.37 12.5,14.04 14.4,12.14 14.4,7.92 19.56,2.76 19.56,1.59 20.26,0.89 21.25,0.89 21.95,1.59 21.95,2.58 20.98,3.54 v20.98,5.41
MSP430-TEST
  Top 0.254: J1.2 30.06,2.08 28.87,0.89 27.88,0.89 27.03,1.74 27.03,2.58 26.33,3.28 22.36,3.28 20.45,5.19 20.45,5.63 20.47,5.65 U2.19
N$1  (via drill 0.35)
  other vias: 6.27,10.24
N$2  (via drill 0.35)
  other vias: 7.04,10.24
N$3
  Top 0.293: U4.1 2.94,10.83
  Top 0.34: 2.94,10.83 ANT1.1
N$4  (via drill 0.35)
  other vias: 6.3,11.46
N$5  (via drill 0.35)
  other vias: 7.01,11.46
N$6  (via drill 0.35)
  other vias: 5.51,11.48
N$7  (via drill 0.35)
  other vias: 5.51,12.37
N$8  (via drill 0.35)
  other vias: 5.51,13.33
N$9  (via drill 0.35)
  other vias: 5.51,14.3
N$10  (via drill 0.35)
  other vias: 5.51,15.24
N$11  (via drill 0.35)
  other vias: 5.51,16.08
N$12  (via drill 0.35)
  other vias: 5.51,16.97
N$13  (via drill 0.35)
  other vias: 5.51,17.91
N$14  (via drill 0.35)
  other vias: 5.51,19
N$15  (via drill 0.35)
  other vias: 5.51,20.12
N$16  (via drill 0.35)
  other vias: 5.51,21.13
N$17  (via drill 0.35)
  other vias: 5.51,22.12
N$18  (via drill 0.35)
  other vias: 5.51,23.16
N$19
  Bottom 0.254: R1.1 D1.A
N$20
  Bottom 0.254: R3.1 27.91,14.39 D2.A
N$21  (via drill 0.35)
  other vias: 5.49,24.08
N$22  (via drill 0.35)
  other vias: 5.49,25.02
N$23  (via drill 0.35)
  other vias: 5.51,10.19
N$24  (via drill 0.35)
  other vias: 5.49,9.14
N$25  (via drill 0.35)
  other vias: 5.49,8
N$26  (via drill 0.35)
  other vias: 5.49,6.88
N$27  (via drill 0.35)
  other vias: 5.46,5.79
N$28  (via drill 0.35)
  other vias: 5.44,4.7
P1.0
  Top 0.254: U2.39 33.55,11.9 J5.4
P1.1
  Top 0.254: U2.38 32.78,11.4 J5.3
P1.2
  Top 0.254: U2.37 32.04,10.9 34.23,8.71 J5.2
P1.3  (via drill 0.35)
  Top 0.254: U2.36 31.05,10.4 31.24,10.21 v31.27,10.21
  Bottom 0.254: v31.27,10.21 31.43,10.21 J5.1
P2.2  (via drill 0.35)
  Top 0.254: U2.31 26.47,8.38 25.63,9.22 v25.6,9.22
  Bottom 0.254: v25.6,9.22 25.6,9.9 25.7,10 25.7,17.3 26.27,17.86 26.55,17.86 31.46,22.77 J9.3
P2.3  (via drill 0.35)
  Top 0.254: U2.30 25.97,7.51 25.97,7.52 25.97,8.34 25.62,8.69 25.38,8.69 25.07,9 25.07,9.44 25.38,9.75 25.82,9.75 26.13,9.44 26.13,9.25 27.13,8.26 v28.63,8.26 | v31.98,19.66 31.98,23.84 J9.4
  Bottom 0.254: v28.63,8.26 28.63,11.42 29,11.79 29,13.78 32.51,17.3 32.51,19.13 v31.98,19.66
P3.4  (via drill 0.35)
  Top 0.254: U2.26 23.97,4.79 24.16,4.6 v24.18,4.6
  Bottom 0.254: v24.18,4.6 24.81,3.97 26.16,3.97 26.75,4.56 28.18,4.56 28.47,4.85 J7.1
P3.5  (via drill 0.35)
  Top 0.254: U2.27 24.47,5.41 25.37,4.5 v25.4,4.5
  Bottom 0.254: J7.2 30.82,5.61 28.64,5.61 27.98,4.94 26.59,4.94 26.17,4.51 25.42,4.51 v25.4,4.5
P3.6  (via drill 0.35)
  Top 0.254: U2.28 24.97,5.96 24.93,5.92 24.93,5.48 25.24,5.17 25.79,5.17 25.93,5.03 v25.95,5.04
  Bottom 0.254: v25.95,5.04 26.23,5.32 27.78,5.32 28.44,5.99 31.88,5.99 32.84,5.03 J7.3
P3.7  (via drill 0.35)
  Top 0.254: U2.29 25.47,5.85 25.54,5.78 v25.46,5.7
  Bottom 0.254: v25.46,5.7 27.6,5.7 28.28,6.39 33.01,6.39 34.11,5.28 J7.4
P4.2  (via drill 0.35)
  Top 0.254: U2.64 18.71,19.02 18.69,19.02 v18.69,19.05
  Bottom 0.254: v18.69,19.05 23.65,24 28.63,24 28.92,24.3 J9.1
P4.3  (via drill 0.35)
  Top 0.254: U2.1 17.6,18.73 17.42,18.9 v17.42,18.92
  Bottom 0.254: v17.42,18.92 23.09,24.59 27.85,24.59 28.61,25.34 29.23,25.34 29.98,24.59 J9.2
P9.0
  Top 0.254: U2.40 33.21,12.4 J4.1
P9.1
  Top 0.254: U2.41 32.44,12.9 J4.2
P9.2
  Top 0.254: U2.42 31.67,13.4 J4.3
P9.3
  Top 0.254: U2.43 30.9,13.9 J4.4
P9.4
  Top 0.254: J6.1 34.24,18.49 34.21,18.49 33.45,17.73 33.45,17.04 30.81,14.4 U2.44
P9.5
  Top 0.254: U2.45 30.77,14.9 33.07,17.2 33.07,18.34 33.4,18.67 33.4,19.81 J6.2
P9.6
  Top 0.254: U2.46 30.61,15.4 32.64,17.42 32.64,18.64 32.97,18.97 32.97,20.64 J6.3
P9.7  (via drill 0.35)
  Top 0.254: U2.47 30.15,15.9 30.4,16.15 v30.4,16.21
  Bottom 0.254: v30.4,16.21 30.4,19.34 J6.4
PJ.0  (via drill 0.35)
  Top 0.254: U2.21 21.47,8.02 22.76,9.32 22.76,10.21 24.67,12.11 25.98,12.11 25.98,12.12 v26.24,12.4
  Bottom 0.254: v26.24,12.4 26.7,12.86 R3.2
PJ.1  (via drill 0.35)
  Top 0.254: U2.22 21.97,7.84 23.14,9.01 23.14,9.69 23.48,10.03 24.67,10.03 26.77,12.13 26.77,14.86 v26.49,15.14
  Bottom 0.254: v26.49,15.14 26.49,16.08 R1.2
RBIAS
  Top 0.254: U3.17 12.1,8.61 R4.1
RF_N
  Top 0.254: U3.13 9.72,11.4 9.66,11.46 9.02,11.46 9.01,11.45 U4.3
RF_P
  Top 0.254: U3.12 9.72,11.9 9.66,11.85 9.02,11.85 9.01,11.86 U4.4
VCC
  Bottom 0.254: 20.36,8.51 C1.2
  Bottom 0.406: U1.1 22.07,8.51 | 22.07,8.51 20.36,8.51 | C1.2 20.33,9.72 21.01,10.39 U1.3 | 22.07,8.51 20.82,7.26 17.27,7.26 16.74,6.73 16.74,6.23 20.75,2.22 J1.6
VOUT  (via drill 0.35)
  Top 0.254: U2.63 19.97,20.28 C10.1 | 19.89,22.19 C13.1 | U2.48 C8.1 | 30.86,7.78 C12.1 | U2.18 19.97,5.86 C4.1 | U2.35 30.22,9.9 C9.1 | U2.52 25.47,19.24 25.89,19.67 C14.2 | U3.9 12.1,14.08 11.71,14.46 11.71,15.02 C18.1 11.34,15.07 v10.64,15.77 | U3.4 14.95,11.9 15.29,12.25 15.29,15.31 15.64,15.66 C17.1 16.51,16.4 16.51,18.01 v16.76,18.26 | U3.18 12.6,8.88 12.55,8.83 12.55,8.39 12.6,8.34 C21.2 12.61,7.67 v13.74,7.67 | v8.81,7.62 8.86,7.67 C22.2 10.45,8.26 10.45,8.76 10.7,9.01 U3.15 | U3.14 10.22,10.9 9.63,10.32 9.63,9.04 C20.1 8.46,7.87 v8.08,7.87 | U3.11 10.7,12.78 C19.1 9.37,14.13 9.37,14.91 v8.99,15.29
  Top 0.406: C10.1 C13.1 | v19.89,23.52 19.89,22.19 | C9.1 30.87,7.93 C12.1 | v30.86,6.96 30.86,7.78 | C4.1 18.78,3.4 C5.1 18.8,3.34 v18.8,2.21 | C8.1 C11.1 30.67,17.42 v31.85,17.42 | v25.91,23.39 25.91,22.31 C15.2 C14.2
  Bottom 0.254: U5.2 v20.52,13.26 | U1.5 24.83,8.55 | C3.2 27.24,8.55 | v17.35,6.48 18.53,6.48 R2.2
  Bottom 0.406: 24.83,8.55 C3.2 | 27.24,8.55 v28.12,7.67
  pour VOUT: 36.45,26.54 36.45,-0.61 5.82,-0.61 5.82,26.54
XOSC-Q1
  Top 0.254: X2.1 10.36,18.75 C23.1 12.5,18.27 12.5,14.08 12.6,13.98 U3.8
XOSC-Q2
  Top 0.254: C24.1 6.55,17.06 X2.3 9.74,15.38 9.96,15.16 10.2,15.16 11.6,13.76 U3.10

### Text on the board
tNames: ULP-SENSE / KSY-2019